# EAGLE design tricorder-sensors-mk-1.1 (EAGLE 7.5.0)
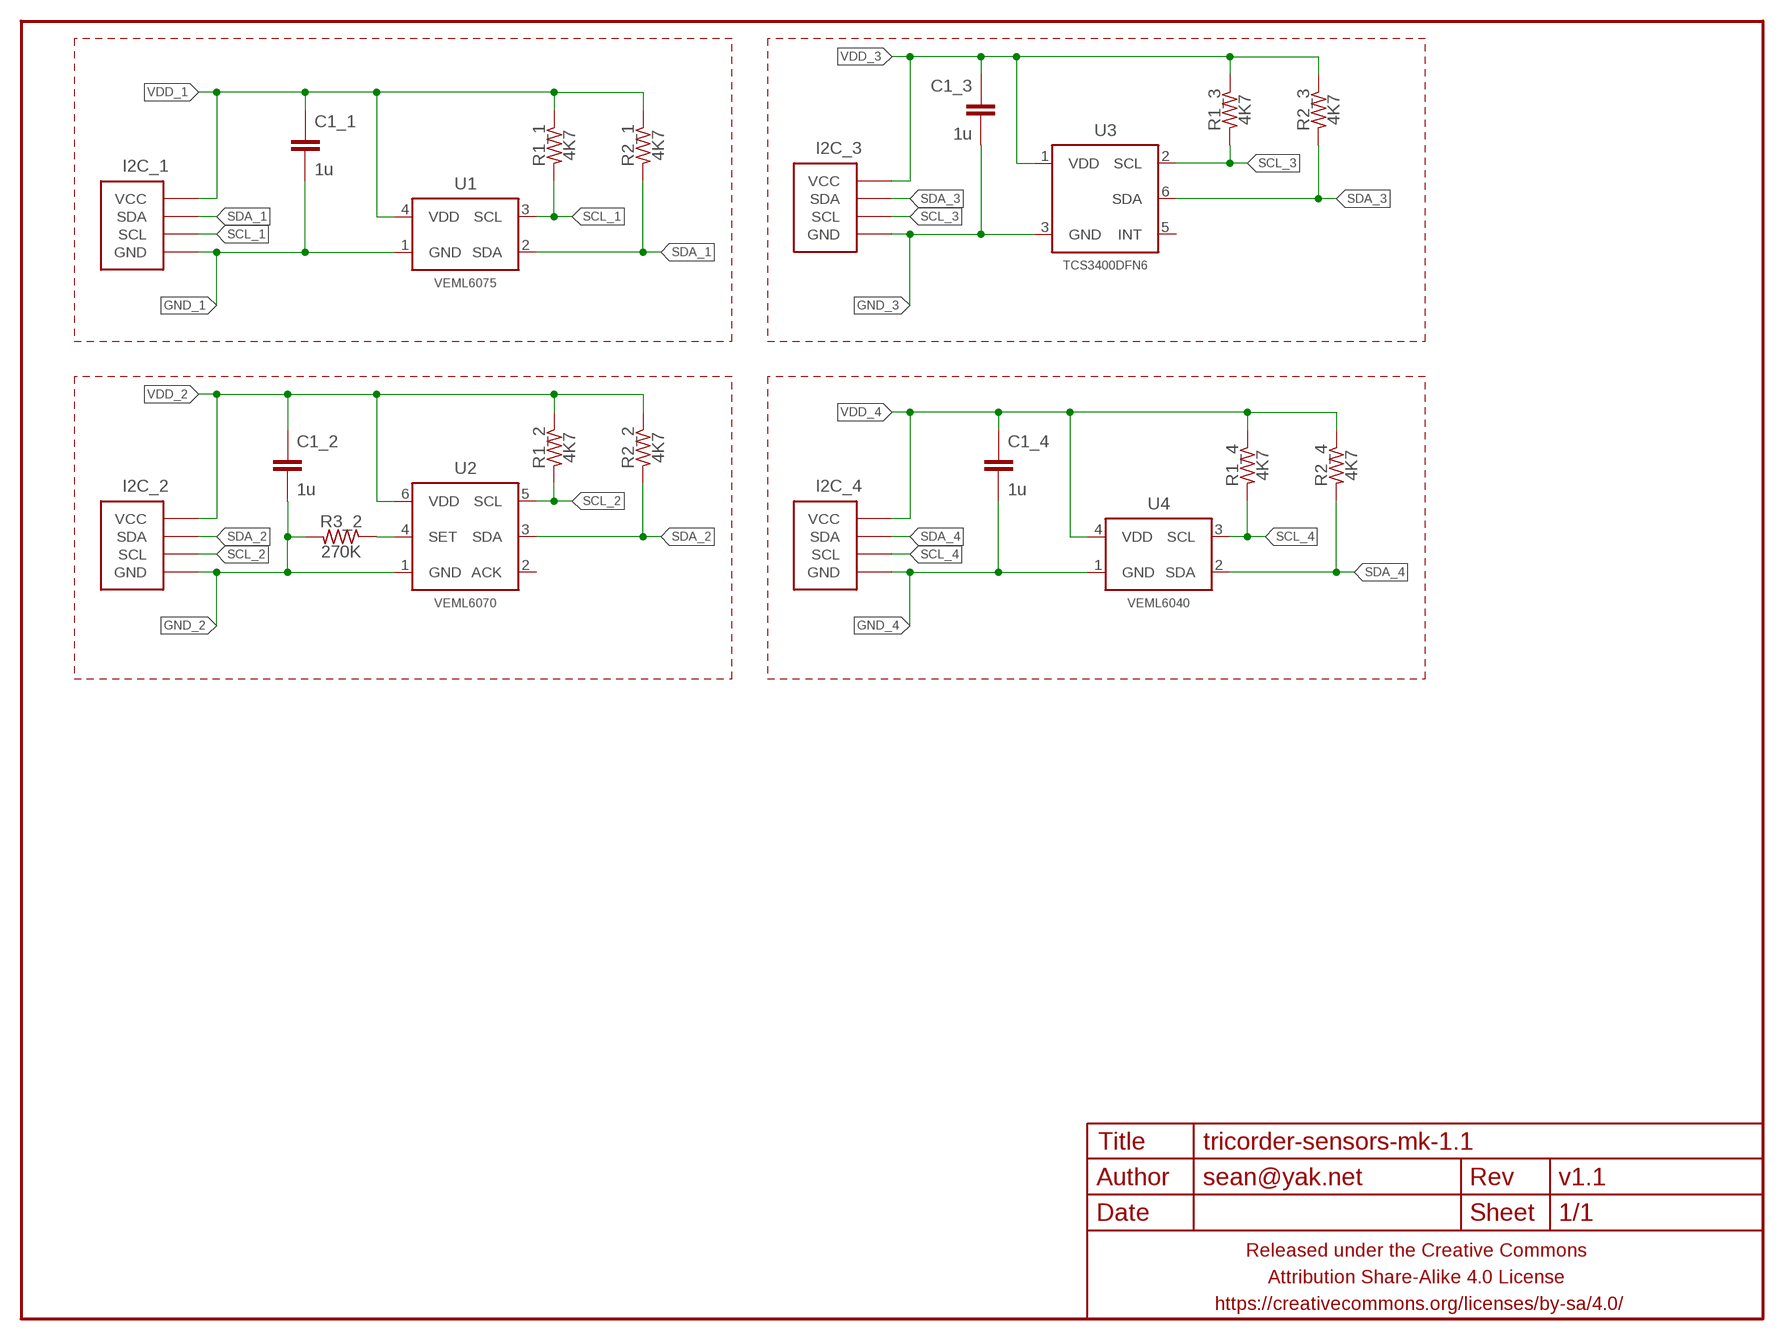
[diagram p0: schematic, sheet 1]

## Parts
C1_1  1u  CAPACITOR-CERAMICC0603  [C0603]
C1_2  1u  CAPACITOR-CERAMICC0603  [C0603]
C1_3  1u  CAPACITOR-CERAMICC0603  [C0603]
C1_4  1u  CAPACITOR-CERAMICC0603  [C0603]
FRAME1  FRAME-LETTERNO_PACKAGE  [DUMMY]
I2C_1  M04-I2CPTH-0.1IN-CENTERED  [1X04-PTH-VERT-I2C-CENTERED]
I2C_2  M04-I2CPTH-0.1IN-CENTERED  [1X04-PTH-VERT-I2C-CENTERED]
I2C_3  M04-I2CPTH-0.1IN-CENTERED  [1X04-PTH-VERT-I2C-CENTERED]
I2C_4  M04-I2CPTH-0.1IN-CENTERED  [1X04-PTH-VERT-I2C-CENTERED]
R1_1  4K7  RESISTORR0603  [R0603]
R1_2  4K7  RESISTORR0603  [R0603]
R1_3  4K7  RESISTORR0603  [R0603]
R1_4  4K7  RESISTORR0603  [R0603]
R2_1  4K7  RESISTORR0603  [R0603]
R2_2  4K7  RESISTORR0603  [R0603]
R2_3  4K7  RESISTORR0603  [R0603]
R2_4  4K7  RESISTORR0603  [R0603]
R3_2  270K  RESISTORR0603  [R0603]
U1  VEML6075  [OPLGA4]
U2  VEML6070  [OPLGA6]
U3  TCS3400DFN6  [TCS3400_DFN6]
U4  VEML6040  VEML6075  [OPLGA4]

## Nets
GND_1: C1_1.2 I2C_1.GND U1.1(GND)
GND_2: C1_2.2 I2C_2.GND R3_2.2 U2.1(GND)
GND_3: C1_3.2 I2C_3.GND U3.3(GND)
GND_4: C1_4.2 I2C_4.GND U4.1(GND)
N$1: R3_2.1 U2.4(SET)
SCL_1: I2C_1.SCL R1_1.2 U1.3(SCL)
SCL_2: I2C_2.SCL R1_2.2 U2.5(SCL)
SCL_3: I2C_3.SCL R1_3.2 U3.2(SCL)
SCL_4: I2C_4.SCL R1_4.2 U4.3(SCL)
SDA_1: I2C_1.SDA R2_1.2 U1.2(SDA)
SDA_2: I2C_2.SDA R2_2.2 U2.3(SDA)
SDA_3: I2C_3.SDA R2_3.2 U3.6(SDA)
SDA_4: I2C_4.SDA R2_4.2 U4.2(SDA)
VDD_1: C1_1.1 I2C_1.VCC R1_1.1 R2_1.1 U1.4(VDD)
VDD_2: C1_2.1 I2C_2.VCC R1_2.1 R2_2.1 U2.6(VDD)
VDD_3: C1_3.1 I2C_3.VCC R1_3.1 R2_3.1 U3.1(VDD)
VDD_4: C1_4.1 I2C_4.VCC R1_4.1 R2_4.1 U4.4(VDD)
Unconnected: U2.2(ACK) U3.5(INT)

## Library data of the parts
C1_1-C1_4 = a_parts:CAPACITOR-CERAMIC: CAPACITOR, European symbol
FRAME1 = a_parts:FRAME-LETTER: Schematic Frame Standard 8.5x11 US Letter frame; DESIGNER: sean@yak.net; VERSION: v1.1
I2C_1-I2C_4 = a_parts:M04-I2C
R1_1-R1_4 R2_1-R2_4 R3_2 = a_parts:RESISTOR: RESISTOR, American symbol
U1 U4 = a_parts:VEML6075
U2 = a_parts:VEML6070
U3 = a_parts:TCS3400

## Module SENSOR_VEML6075
Ports: 

### Library data of the parts

## Board
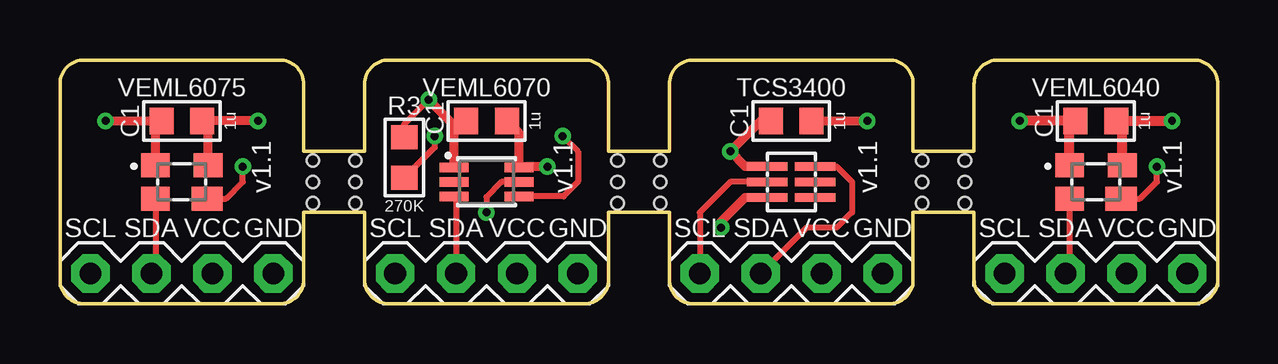
[diagram p1: board, top side]
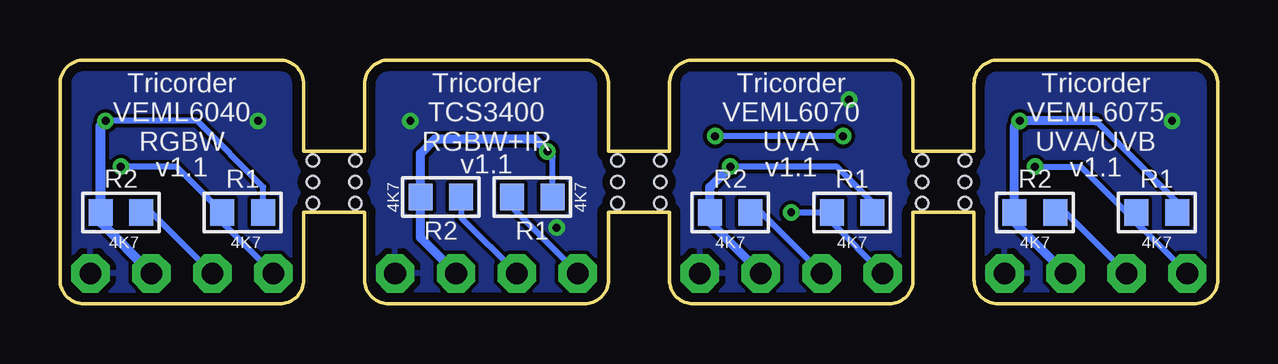
[diagram p2: board, bottom side, seen from below]

Size 48.26 x 10.16 mm. Coordinates in mm from the lower left corner, seen from the top.
Outline: 10.16,6.35 10.16,9.16 arc90 9.16,10.16 1,10.16 arc90 0,9.16 0,1 arc90 1,0 9.16,0 arc90 10.16,1 10.16,3.81 12.7,3.81 12.7,1 arc90 13.7,0 21.86,0 arc90 22.86,1 22.86,3.81 25.4,3.81 25.4,1 arc90 26.4,0 34.56,0 arc90 35.56,1 35.56,3.81 38.1,3.81 38.1,1 arc90 39.1,0 47.26,0 arc90 48.26,1 48.26,9.16 arc90 47.26,10.16 39.1,10.16 arc90 38.1,9.16 38.1,6.35 35.56,6.35 35.56,9.16 arc90 34.56,10.16 26.4,10.16 arc90 25.4,9.16 25.4,6.35 22.86,6.35 22.86,9.16 arc90 21.86,10.16 13.7,10.16 arc90 12.7,9.16 12.7,6.35 10.16,6.35
Copper layers (1*16): Top 0.0356mm / dielectric 1.5011mm / Bottom 0.0356mm
Design rules "LaenPCBOrder2": minimum track width 6mil, minimum drill 13mil, track to track 6mil, track to pad 6mil, pad to pad 6mil, via to via 6mil, smd to smd 6mil, copper to edge 15mil, drill to drill 6mil, minimum pad ring 7mil, minimum via ring 7mil, stop-mask expansion 3mil, vias tented up to drill 20mil, thermal gap 10mil
Holes 0.51 mm at 10.54,5.08 10.54,4.19 10.54,5.97 12.32,4.19 12.32,5.08 12.32,5.97 23.24,5.08 23.24,4.19 23.24,5.97 25.02,4.19 25.02,5.08 25.02,5.97 35.94,5.08 35.94,4.19 35.94,5.97 37.72,4.19 37.72,5.08 37.72,5.97

### Footprints (pad centres in the part's own frame; a part is rotated, then mirrored left to right if it is on the bottom)
C0603 = smd 1 x 1.1: 1 -0.85,0; 2 0.85,0
1X04-PTH-VERT-I2C-CENTERED = drill 0.9 pad 1.6 octagon: GND -3.81,0; SCL 3.81,0; SDA 1.27,0; VCC -1.27,0
R0603 = smd 1 x 1.1: 1 -0.85,0; 2 0.85,0
OPLGA4 = smd 1.2 x 1: 1 -1.1,0.7; 2 -1.1,-0.7; 4 1.1,0.7 | smd 1.3 x 1: 3 1.05,-0.7
OPLGA6 = smd 1.2 x 0.4: 1 -1.35,0.6; 2 -1.35,0; 3 -1.35,-0.6; 4 1.35,-0.6; 5 1.35,0; 6 1.35,0.6
TCS3400_DFN6 = smd 1.7 x 0.35: 1 -1,0.65; 2 -1,0; 3 -1,-0.65; 4 1,-0.65; 5 1,0; 6 1,0.65

### Placement (x,y rotation side)
C1_1  5.08,7.62 180 top
C1_2  17.78,7.62 180 top
C1_3  30.48,7.62 0 top
C1_4  43.18,7.62 180 top
FRAME1  0,0 0 top
I2C_1  5.08,1.27 180 top
I2C_2  17.78,1.27 180 top
I2C_3  30.48,1.27 180 top
I2C_4  43.18,1.27 180 top
R1_1  2.54,3.81 180 bottom
R1_2  15.24,3.81 180 bottom
R1_3  28.57,4.45 180 bottom
R1_4  40.64,3.81 180 bottom
R2_1  7.62,3.81 0 bottom
R2_2  20.32,3.81 0 bottom
R2_3  32.38,4.45 0 bottom
R2_4  45.72,3.81 0 bottom
R3_2  14.35,6.1 90 top
U1  5.08,5.08 0 top
U2  17.78,5.08 0 top
U3  30.48,5.08 0 top
U4  43.18,5.08 0 top

### Tracks (layer width: path | path; a pad name or v marks a point on that pad's centre or on a via)
GND_1  (via drill 0.33)
  Top 0.381: U1.1 3.98,7.37 C1_1.2 v1.91,7.62
  pour Bottom: 9.16,10.16 1,10.16 arc90 0,9.16 0,1 arc90 1,0 9.16,0 arc90 10.16,1 10.16,9.16 arc90
GND_2  (via drill 0.33)
  Top 0.254: R3_2.2 14.35,7.49 v15.37,8.51
  Top 0.381: U2.1 16.43,7.12 | v15.37,8.51 16.43,7.45
  Top 0.406: C1_2.2 16.43,7.12 16.43,7.45
  pour Bottom: 22.86,1 22.86,9.16 arc90 21.86,10.16 13.7,10.16 arc90 12.7,9.16 12.7,1 arc90 13.7,0 21.86,0 arc90
GND_3  (via drill 0.33)
  Top 0.381: C1_3.2 v33.66,7.62 | U3.3 28.56,4.43 27.56,3.43 v27.56,3.17
  pour Bottom: 25.4,0.89 25.4,9.16 arc-90 26.4,10.16 34.56,10.16 arc-90 35.56,9.16 35.56,0.99 arc-89 34.57,-0.01 26.41,-0.11 arc-91
GND_4  (via drill 0.33)
  Top 0.406: U4.1 42.08,7.37 C1_4.2 v40.01,7.62
  pour Bottom: 47.26,10.16 39.1,10.16 arc90 38.1,9.16 38.1,1 arc90 39.1,0 47.26,0 arc90 48.26,1 48.26,9.16 arc90
N$1  (via drill 0.33)
  Top 0.254: 14.52,5.25 R3_2.1 15.62,6.52 v15.62,6.99 | v20.95,6.99 21.59,6.35 21.59,5.08 20.99,4.48 U2.4
  Bottom 0.254: v15.62,6.99 v20.95,6.99
SCL_1  (via drill 0.33)
  Top 0.254: U1.3 6.92,4.38 7.62,5.08 v7.62,5.71
  Bottom 0.254: I2C_1.SCL 3.24,3.24 | R1_1.2 3.39,3.39 5.71,5.71 v7.62,5.71
  Bottom 0.305: 3.24,3.24 3.39,3.39
SCL_2  (via drill 0.33)
  Top 0.254: U2.5 18.41,5.08 17.78,4.45 v17.78,3.81
  Bottom 0.254: I2C_2.SCL 16.09,3.39 R1_2.2 v17.78,3.81
SCL_3
  Top 0.254: U3.2 27.94,5.08 26.67,3.81 I2C_3.SCL
  Bottom 0.254: I2C_3.SCL 29.43,4.03 R1_3.2
SCL_4  (via drill 0.33)
  Top 0.254: U4.3 45.02,4.38 45.72,5.08 v45.72,5.71
  Bottom 0.254: I2C_4.SCL 41.49,3.39 R1_4.2 43.4,5.71 v45.72,5.71
SDA_1
  Top 0.254: U1.2 3.98,1.44 I2C_1.SDA
  Bottom 0.254: I2C_1.SDA 6.35,3.81 R2_1.2
SDA_2
  Top 0.254: U2.3 16.51,4.4 I2C_2.SDA
  Bottom 0.254: I2C_2.SDA 19.05,3.81 R2_2.2
SDA_3
  Top 0.254: U3.6 32.37,5.73 33.02,5.08 33.02,3.81 32.38,3.17 31.11,3.17 I2C_3.SDA
  Bottom 0.254: R2_3.2 31.54,3.6 I2C_3.SDA
SDA_4
  Top 0.254: U4.2 42.08,1.44 I2C_4.SDA
  Bottom 0.254: R2_4.2 44.45,3.81 I2C_4.SDA
VDD_1  (via drill 0.33)
  Top 0.381: U1.4 6.18,7.37 C1_1.1 v8.26,7.62
  Bottom 0.254: R1_1.1 1.69,4.23 5.08,7.62
  Bottom 0.381: I2C_1.VCC 8.47,3.39 R2_1.1 8.47,7.41 v8.26,7.62 5.08,7.62
VDD_2  (via drill 0.33)
  Top 0.381: U2.6 19.13,7.12 C1_2.1 | v20.32,5.71 19.16,5.71
  Top 0.406: 19.16,5.71 U2.6
  Bottom 0.254: R1_2.1 14.39,4.23 15.88,5.71 v20.32,5.71
  Bottom 0.381: I2C_2.VCC 21.17,3.39 R2_2.1 21.17,4.87 v20.32,5.71
VDD_3  (via drill 0.33)
  Top 0.381: U3.1 28.56,5.73 v27.94,6.35 29.21,7.62 C1_3.1
  Bottom 0.254: R1_3.1 27.73,6.13 v27.94,6.35
  Bottom 0.381: I2C_3.VCC 33.23,2.75 R2_3.1 33.23,6.26 32.64,6.86 28.45,6.86 v27.94,6.35
VDD_4  (via drill 0.33)
  Top 0.406: U4.4 44.28,7.37 C1_4.1 v46.35,7.62
  Bottom 0.254: R1_4.1 39.79,4.87 42.55,7.62 v46.35,7.62
  Bottom 0.406: v46.35,7.62 46.57,7.41 R2_4.1 46.57,3.39 I2C_4.VCC

### Text on the board
tPlace: VEML6075 | VEML6070 | TCS3400 | VEML6040
bPlace: Tricorder / VEML6075 / UVA/UVB | Tricorder / VEML6070 / UVA | Tricorder / TCS3400 / RGBW+IR | Tricorder / VEML6040 / RGBW
tNames: C1 | R3 | C1 | C1 | C1
bNames: R1 | R2 | R1 | R2 | R1 | R2 | R1 | R2